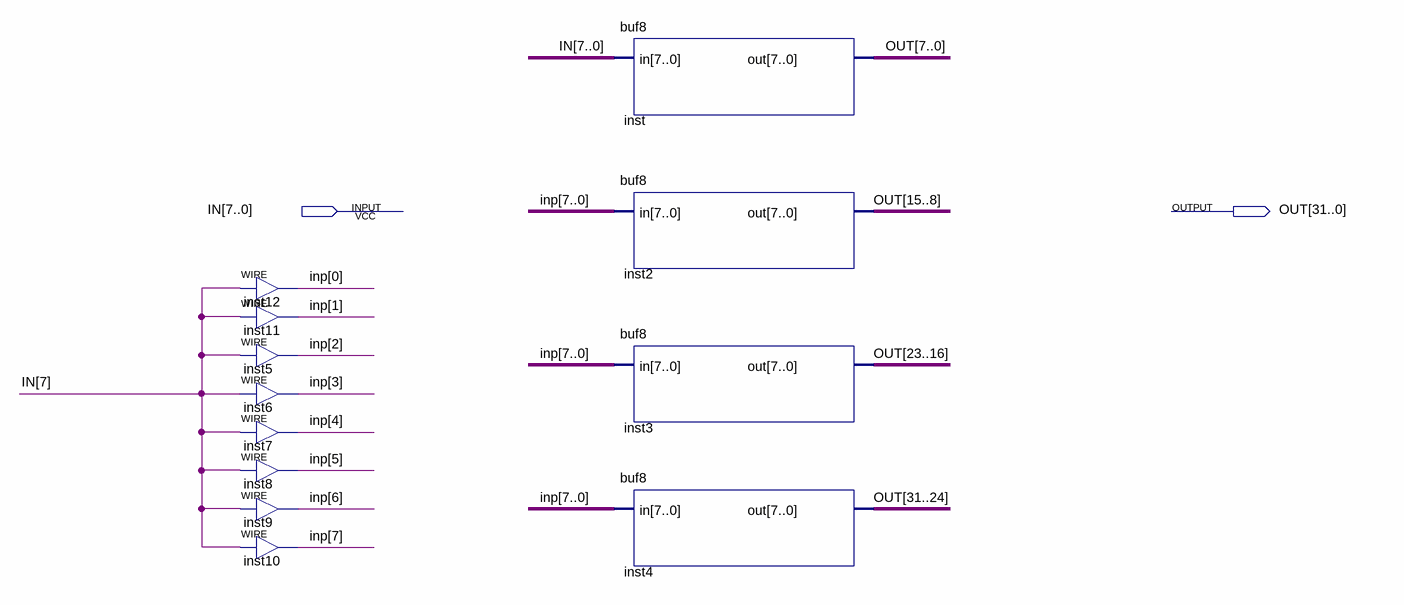
[diagram p0: schematic sheet]
// Quartus schematic shifter8T32signed.bdf as structural Verilog: 12 symbols, 2 pins
module shifter8T32signed (
  input  [7:0] IN,
  output [31:0] OUT
);

  wire [7:0] inp;

  assign inp[0] = IN[7];  // WIRE inst12
  assign inp[1] = IN[7];  // WIRE inst11
  assign inp[2] = IN[7];  // WIRE inst5
  assign inp[3] = IN[7];  // WIRE inst6
  assign inp[4] = IN[7];  // WIRE inst7
  assign inp[5] = IN[7];  // WIRE inst8
  assign inp[6] = IN[7];  // WIRE inst9
  assign inp[7] = IN[7];  // WIRE inst10
  buf8 inst (.in(IN), .out(OUT[7:0]));
  buf8 inst2 (.in(inp), .out(OUT[15:8]));
  buf8 inst3 (.in(inp), .out(OUT[23:16]));
  buf8 inst4 (.in(inp), .out(OUT[31:24]));
endmodule
